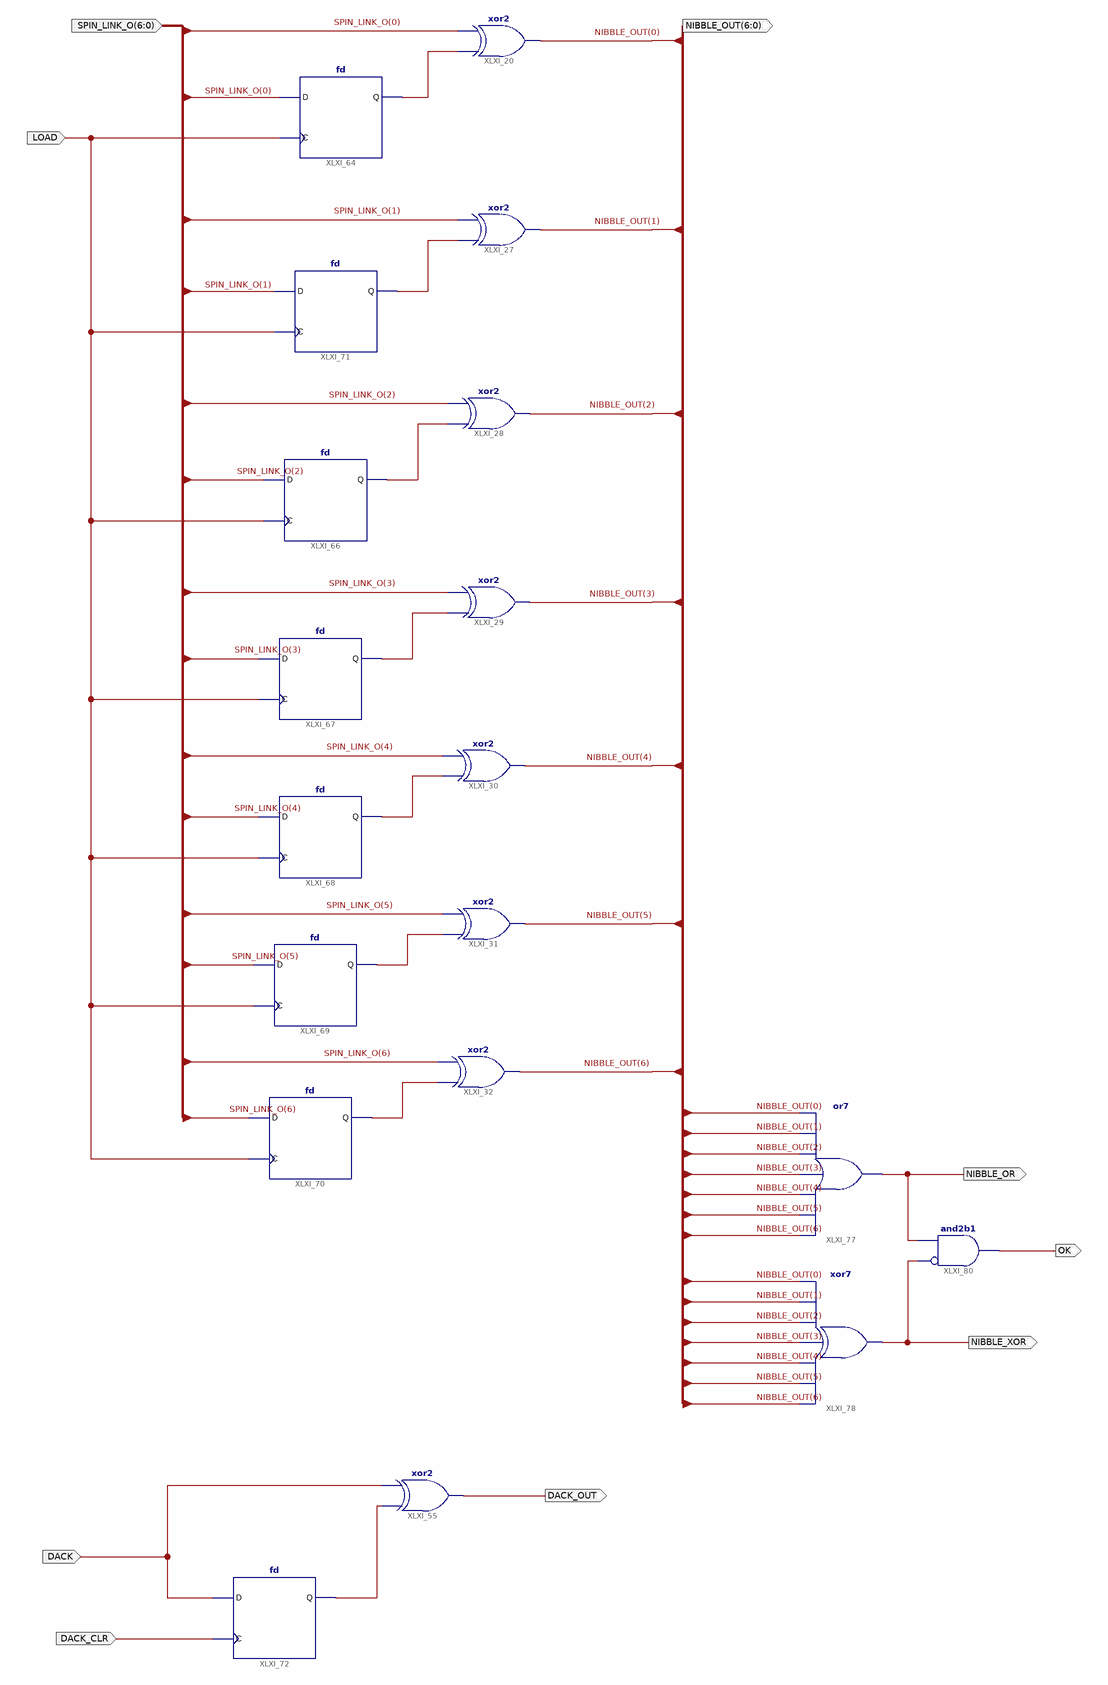
[diagram p0: schematic sheet 1]
// Xilinx ISE schematic Input_buffer.sch (xbr) as structural Verilog: 19 symbols, 9 ports
module Input_buffer (
  input  [6:0] SPIN_LINK_O,
  input  LOAD,
  input  DACK_CLR,
  input  DACK,
  output [6:0] NIBBLE_OUT,
  output DACK_OUT,
  output NIBBLE_OR,
  output NIBBLE_XOR,
  output OK
);

  wire XLXN_6, XLXN_9, XLXN_23, XLXN_24, XLXN_25, XLXN_26, XLXN_28, XLXN_29;

  xor XLXI_20 (NIBBLE_OUT[0], XLXN_6, SPIN_LINK_O[0]);
  xor XLXI_27 (NIBBLE_OUT[1], XLXN_9, SPIN_LINK_O[1]);
  xor XLXI_28 (NIBBLE_OUT[2], XLXN_23, SPIN_LINK_O[2]);
  xor XLXI_29 (NIBBLE_OUT[3], XLXN_24, SPIN_LINK_O[3]);
  xor XLXI_30 (NIBBLE_OUT[4], XLXN_25, SPIN_LINK_O[4]);
  xor XLXI_31 (NIBBLE_OUT[5], XLXN_26, SPIN_LINK_O[5]);
  xor XLXI_32 (NIBBLE_OUT[6], XLXN_28, SPIN_LINK_O[6]);
  fd XLXI_64 (.C(LOAD), .D(SPIN_LINK_O[0]), .Q(XLXN_6));
  fd XLXI_66 (.C(LOAD), .D(SPIN_LINK_O[2]), .Q(XLXN_23));
  fd XLXI_67 (.C(LOAD), .D(SPIN_LINK_O[3]), .Q(XLXN_24));
  fd XLXI_68 (.C(LOAD), .D(SPIN_LINK_O[4]), .Q(XLXN_25));
  fd XLXI_69 (.C(LOAD), .D(SPIN_LINK_O[5]), .Q(XLXN_26));
  fd XLXI_70 (.C(LOAD), .D(SPIN_LINK_O[6]), .Q(XLXN_28));
  fd XLXI_71 (.C(LOAD), .D(SPIN_LINK_O[1]), .Q(XLXN_9));
  xor XLXI_55 (DACK_OUT, XLXN_29, DACK);
  fd XLXI_72 (.C(DACK_CLR), .D(DACK), .Q(XLXN_29));
  or XLXI_77 (NIBBLE_OR, NIBBLE_OUT[6], NIBBLE_OUT[5], NIBBLE_OUT[4], NIBBLE_OUT[3], NIBBLE_OUT[2], NIBBLE_OUT[1], NIBBLE_OUT[0]);
  xor XLXI_78 (NIBBLE_XOR, NIBBLE_OUT[6], NIBBLE_OUT[5], NIBBLE_OUT[4], NIBBLE_OUT[3], NIBBLE_OUT[2], NIBBLE_OUT[1], NIBBLE_OUT[0]);
  and XLXI_80 (OK, ~NIBBLE_XOR, NIBBLE_OR);  // and2b1
endmodule
